# EAGLE design Battery Board v3 (EAGLE 6.5.0)
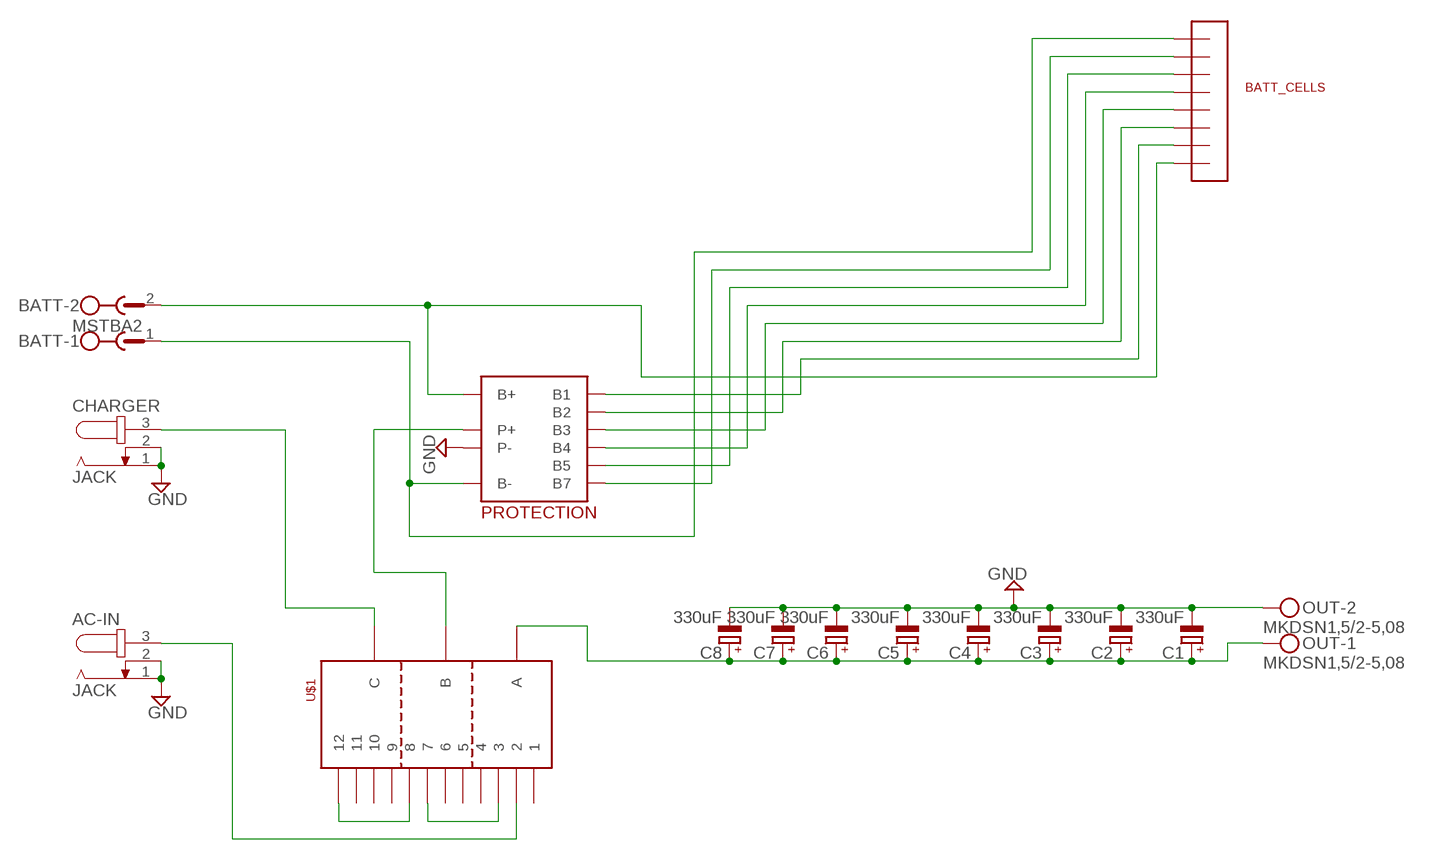
[diagram p0: schematic, sheet 1]

## Parts
AC-IN  JACK  [JACK]
BATT  MSTBA2  [MSTBA2]
BATT_CELLS  JST-XH-8  [8PIN-2.5MM]
C1  330uF  CPOL-EUE5-10.5  [E5-10,5]
C2  330uF  CPOL-EUE5-10.5  [E5-10,5]
C3  330uF  CPOL-EUE5-10.5  [E5-10,5]
C4  330uF  CPOL-EUE5-10.5  [E5-10,5]
C5  330uF  CPOL-EUE5-10.5  [E5-10,5]
C6  330uF  CPOL-EUE5-10.5  [E5-10,5]
C7  330uF  CPOL-EUE5-10.5  [E5-10,5]
C8  330uF  CPOL-EUE5-10.5  [E5-10,5]
CHARGER  JACK  [JACK]
OUT  MKDSN1,5/2-5,08  [MKDSN1,5/2-5,08]
PROTECTION  BMS-LIFEPO4-7S  [BMS-LIFEPO4-7S]
U$1  CK1026  [CK1026]

## Nets
B1: BATT_CELLS.P$7 PROTECTION.B1
B2: BATT_CELLS.P$6 PROTECTION.B2
B3: BATT_CELLS.P$5 PROTECTION.B3
B4: BATT_CELLS.P$4 PROTECTION.B4
B5: BATT_CELLS.P$3 PROTECTION.B5
B7: BATT_CELLS.P$2 PROTECTION.B7
B+: BATT.2 BATT_CELLS.P$8 PROTECTION.B+
B-: BATT.1 BATT_CELLS.P$1 PROTECTION.B-
GND: AC-IN.1 AC-IN.2 C1.- C2.- C3.- C4.- C5.- C6.- C7.- C8.- CHARGER.1 CHARGER.2 OUT.2 PROTECTION.P-
N$1: C1.+ C2.+ C3.+ C4.+ C5.+ C6.+ C7.+ C8.+ OUT.1 U$1.A
N$2: AC-IN.3 U$1.2
N$3: PROTECTION.P+ U$1.B
N$4: U$1.3 U$1.7
N$5: U$1.8 U$1.12
N$14: CHARGER.3 U$1.C
Unconnected: U$1.1 U$1.4 U$1.5 U$1.6 U$1.9 U$1.10 U$1.11

## Library data of the parts
AC-IN CHARGER = custom:JACK
BATT = con-phoenix-508:MSTBA2: PHOENIX; MF: FARNELL; MPN: 1757242; OC_FARNELL: 3705171; OC_NEWARK: 71C4161
BATT_CELLS = custom:JST-XH-8
C1-C8 = rcl:CPOL-EU: POLARIZED CAPACITOR, European symbol
OUT = con-phoenix-508:MKDSN1,5/2-5,08: MKDSN 1,5/ 2-5,08 Printklemme Nennstrom: 13,5 A Nennspannung: 250 V Rastermaß: 5,08 mm Polzahl: 2 Anschlussart: Schraubanschluss Montage: Löten Anschlussrichtung Leiter/Platine: 0 ° Artikelnummer: 1729128 Source: http://eshop.phoenixcontact.com .. 1729128.pdf; MPN: MKDSN 1,5/2-5.08; OC_FARNELL: 1792903; OC_NEWARK: 30M2397
PROTECTION = custom:BMS-LIFEPO4-7S
U$1 = custom:CK1026: 3 Poles 4 Ways Rotary switch

## Board
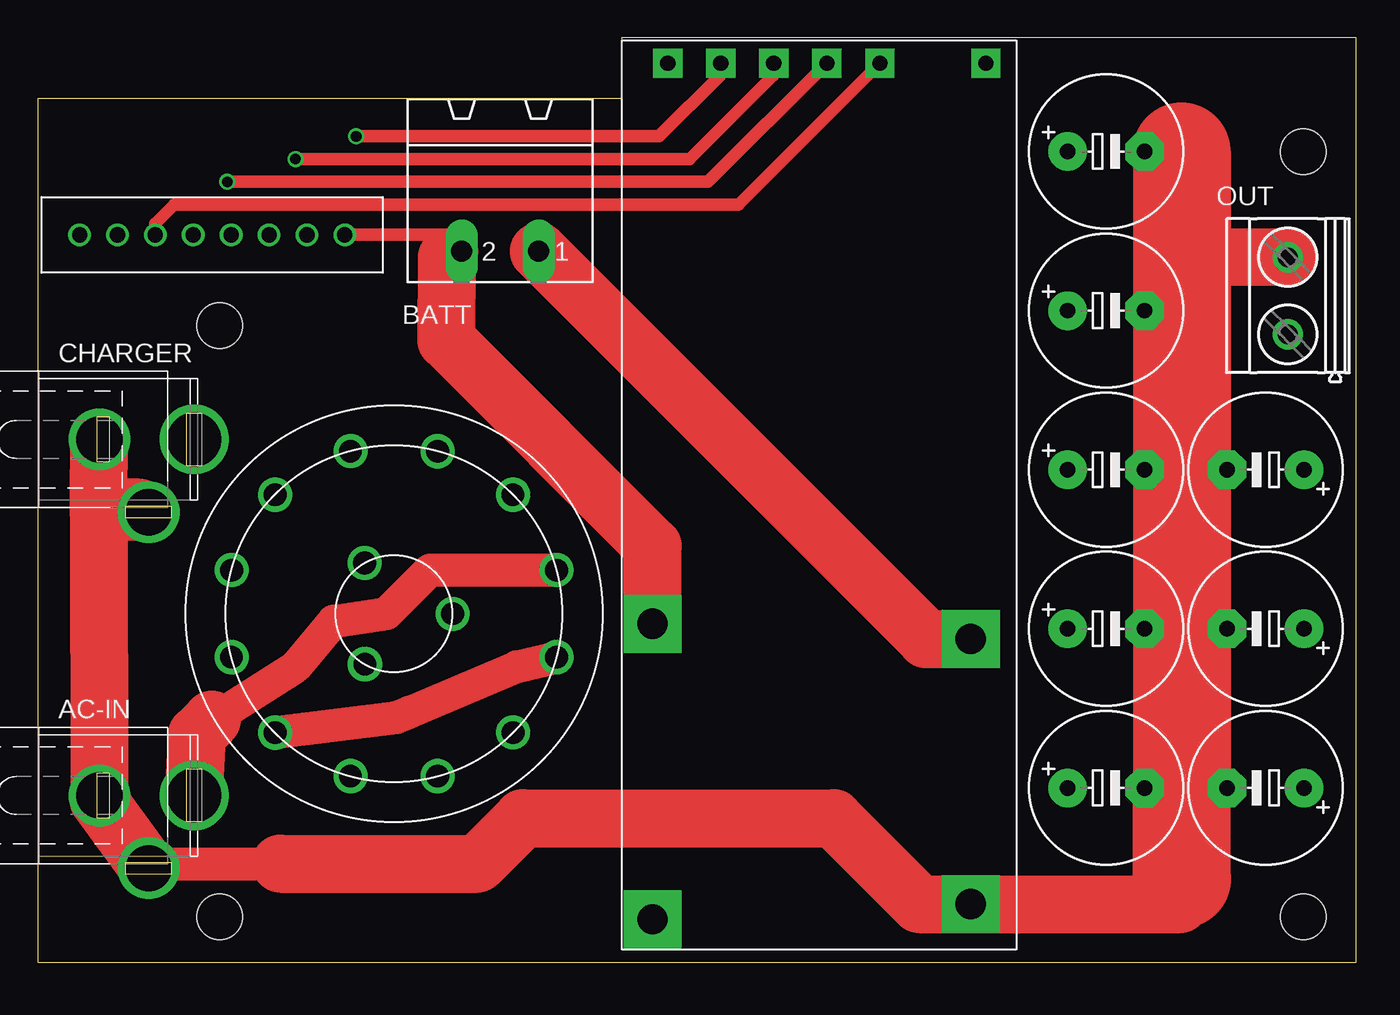
[diagram p1: board, top side]
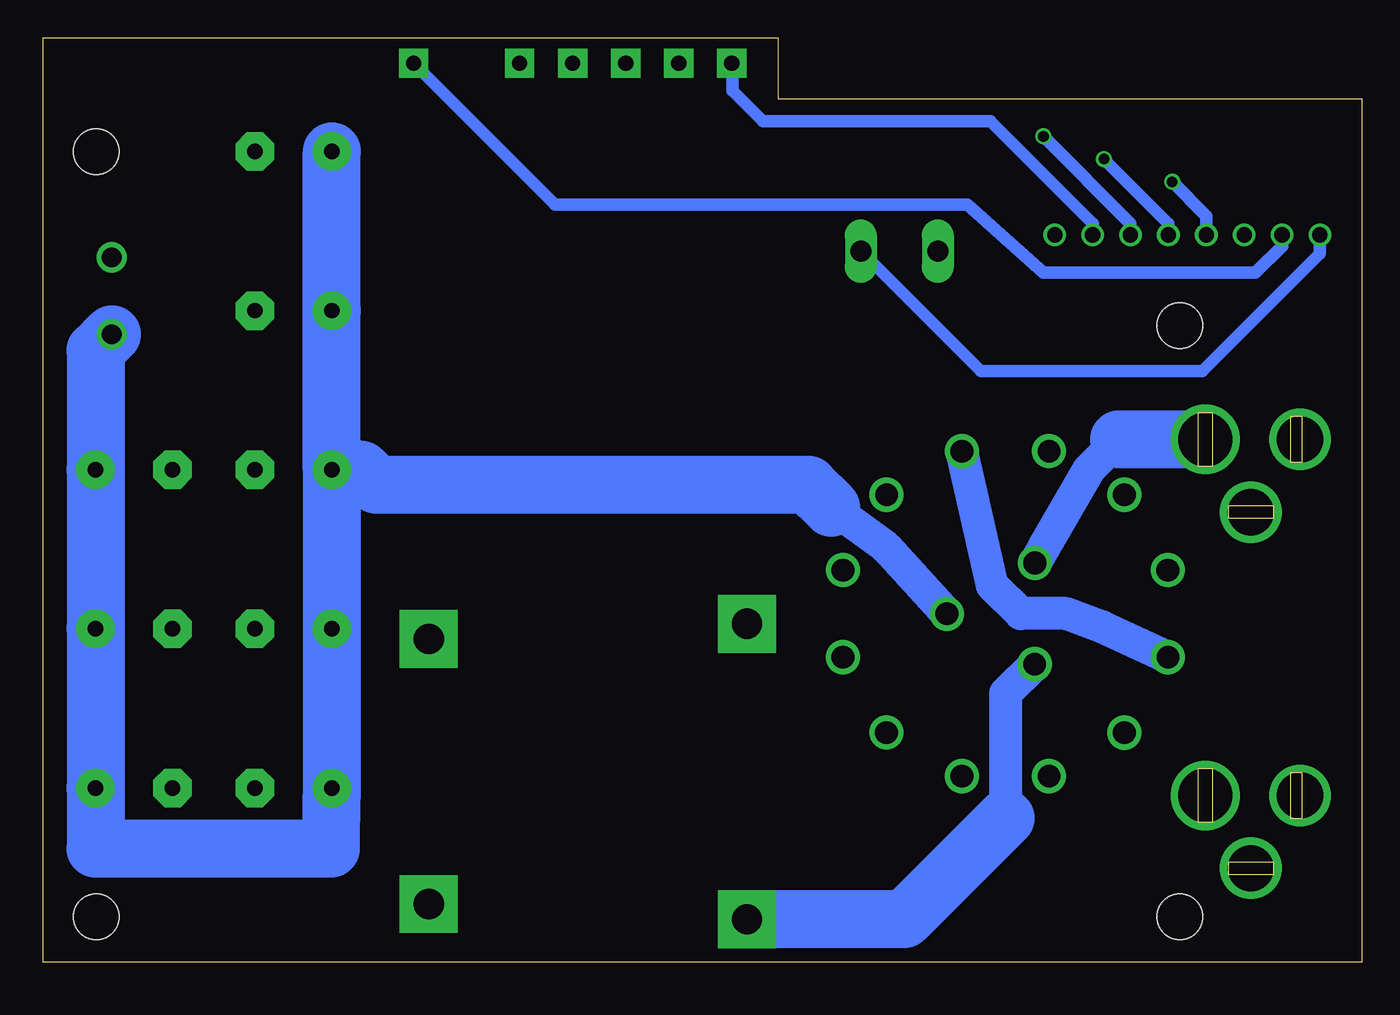
[diagram p2: board, bottom side, seen from below]

Size 87 x 61 mm. Coordinates in mm from the lower left corner, seen from the top.
Outline: 0,0 87,0 87,61 38.5,61 38.5,57 0,57 0,0
Copper layers (1*16): Top 0.0356mm / dielectric 1.5011mm / Bottom 0.0356mm
Design rules "LaenPCBOrder": minimum track width 6mil, minimum drill 13mil, track to track 6mil, track to pad 6mil, pad to pad 6mil, via to via 6mil, smd to smd 6mil, copper to edge 15mil, drill to drill 6mil, minimum pad ring 7mil, minimum via ring 7mil, stop-mask expansion 4mil, vias tented up to drill 0mil, thermal gap 10mil
Holes 3 mm at 12,3 83.5,53.5 83.5,3 12,42

### Footprints (pad centres in the part's own frame; a part is rotated, then mirrored left to right if it is on the bottom)
JACK = drill 3.048: 1 0.56,0; 2 3.81,-4.8 | drill 3.556: 3 6.81,0
MSTBA2 = drill 1.397 long: 1 -2.54,5.08; 2 2.54,5.08
8PIN-2.5MM = drill 1: P$1 0,8.75; P$2 0,6.25; P$3 0,3.75; P$4 0,1.25; P$5 0,-1.25; P$6 0,-3.75; P$7 0,-6.25; P$8 0,-8.75
E5-10,5 = drill 1.016 pad 2.54: + -2.54,0 | drill 1.016 pad 2.54 octagon: - 2.54,0
MKDSN1,5/2-5,08 = drill 1.3 pad 2: 1 -2.561,0.025; 2 2.519,0.025
BMS-LIFEPO4-7S = drill 1 pad 1.93 square: B1 28.5,10; B2 28.5,6.5; B3 28.5,3; B4 28.5,-0.5; B5 28.5,-4; B7 28.5,-11 | drill 2 pad 3.81 square: B+ -8.5,11; B- -9.5,-10; P+ -28,11; P- -27,-10
CK1026 = drill 1.5: 1 -2.87,-10.72; 2 -7.85,-7.85; 3 -10.72,-2.87; 4 -10.72,2.87; 5 -7.85,7.85; 6 -2.87,10.72; 7 2.87,10.72; 8 7.85,7.85; 9 10.72,2.87; 10 10.72,-2.87; 11 7.85,-7.85; 12 2.87,-10.72; A -3.35,-1.925; B 0,3.85; C 3.35,-1.925

### Placement (x,y rotation side)
AC-IN  3.5,11 0 top
BATT  30.5,52 180 top
BATT_CELLS  11.5,48 90 top
C1  81,32.5 180 top
C2  81,22 180 top
C3  81,11.5 180 top
C4  70.5,11.5 0 top
C5  70.5,22 0 top
C6  70.5,32.5 0 top
C7  70.5,43 0 top
C8  70.5,53.5 0 top
CHARGER  3.5,34.5 0 top
OUT  82.5,44 90 top
PROTECTION  51.56,30.83 90 top
U$1  23.5,23 150 top

### Tracks (layer width: path | path; a pad name or v marks a point on that pad's centre or on a via)
B1
  Bottom 0.813: PROTECTION.B1 41.5,59.27 41.5,57.5 39.5,55.5 24.5,55.5 17.75,48.75 BATT_CELLS.P$7
B2  (via drill 0.7)
  Top 0.813: PROTECTION.B2 45,59.27 45,58.5 41,54.5 v21,54.5
  Bottom 0.813: v21,54.5 15.25,48.75 BATT_CELLS.P$6
B3  (via drill 0.7)
  Top 0.813: PROTECTION.B3 48.5,59.27 48.5,58.5 43,53 v17,53
  Bottom 0.813: v17,53 12.75,48.75 BATT_CELLS.P$5
B4  (via drill 0.7)
  Top 0.813: PROTECTION.B4 44.23,51.5 v12.5,51.5
  Bottom 0.813: v12.5,51.5 10.25,49.25 BATT_CELLS.P$4
B5
  Top 0.813: PROTECTION.B5 46.23,50 9,50 7.75,48.75 BATT_CELLS.P$3
B7
  Bottom 0.813: PROTECTION.B7 53.23,50 26,50 21,45.5 7,45.5 5.25,47.25 BATT_CELLS.P$2
B+
  Top 0.813: BATT_CELLS.P$8 26.88,48 BATT.2
  Top 2.184: 27,46.5 BATT.2
  Top 3.81: PROTECTION.B+ 40.56,27.44 26.96,41.04 27,46.5
B-
  Top 3.81: BATT.1 58.63,21.33 PROTECTION.B-
  Bottom 0.813: BATT_CELLS.P$1 2.75,46.75 10.5,39 25.12,39 BATT.1
GND
  Top 2.184: AC-IN.2 8.3,6.5 16,6.5 | 75.5,46.5 75.48,53.52 75.48,53.5 C8.- | 75.5,42.54 75.5,43 C7.- 73.04,42.96 | C3.- 78.46,11.54 75.5,11.5 | 75.5,11.5 75,11.46 C4.- 75.5,11.5 | C5.- 75.5,22 C2.- | C1.- 75.5,32.5 C6.-
  Top 3.81: AC-IN.2 4,10.7 AC-IN.1 4,29.7 CHARGER.2 6.7,30 4,30 4,30.5 CHARGER.1 | 16,6.5 29,6.5 32,9.5 52.5,9.5 58.17,3.83 PROTECTION.P- 75.37,3.83 75.5,5.5 | OUT.2 75.5,46.5
  Top 6.452: 75.48,53.52 75.5,43 | 75.5,42.54 75.5,32.5 75.5,22 75.5,11.5 75.5,5.5
N$1
  Bottom 2.184: U$1.A 31.36,27.36 35,30 | 67.96,11.04 C4.+
  Bottom 3.81: 35,30 36.5,31.5 65,31.5 66,32.5 C6.+ | OUT.1 83.54,40.37 C1.+ C2.+ C3.+ 83.54,7.5 68,7.5 67.96,11.04 | C6.+ C5.+ C4.+ | C6.+ C7.+ C8.+
N$2
  Top 2.184: 11.5,16 17,19.5 19.5,22.5 23,23 25.87,25.87 U$1.2
  Top 3.81: AC-IN.3 10.5,15 11.5,16
N$3
  Bottom 2.184: U$1.B 23.5,17.74 23.5,9.5
  Bottom 3.81: 23.5,9.5 30.17,2.83 PROTECTION.P+
N$4
  Top 2.184: U$1.7 23.65,16.15 24.5,16.5 31.59,19.5 U$1.3
N$5
  Bottom 2.184: U$1.8 17.13,22.13 19.5,23 22.5,23 24.38,24.88 U$1.12
N$14
  Bottom 2.184: 16,34.5 18,32.5 20.9,27.5 U$1.C
  Bottom 3.81: CHARGER.3 16,34.5